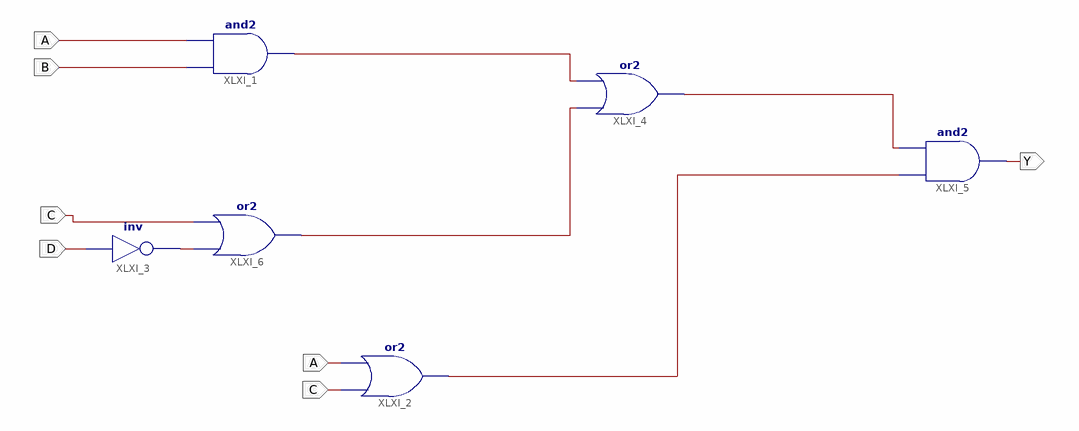
[diagram p0: schematic sheet 1]
// Xilinx ISE schematic lab2.sch (spartan3adsp) as structural Verilog: 6 symbols, 5 ports
module lab2 (
  input  A,
  input  B,
  input  C,
  input  D,
  output Y
);

  wire XLXN_15, XLXN_17, XLXN_18, XLXN_19, XLXN_20;

  and XLXI_1 (XLXN_17, B, A);
  or XLXI_2 (XLXN_18, C, A);
  not XLXI_3 (XLXN_20, D);
  or XLXI_4 (XLXN_19, XLXN_15, XLXN_17);
  and XLXI_5 (Y, XLXN_18, XLXN_19);
  or XLXI_6 (XLXN_15, XLXN_20, C);
endmodule
